# Altium schematic sheet Power.SchDoc
size A4; SheetNumber: 2; SheetTotal: 5
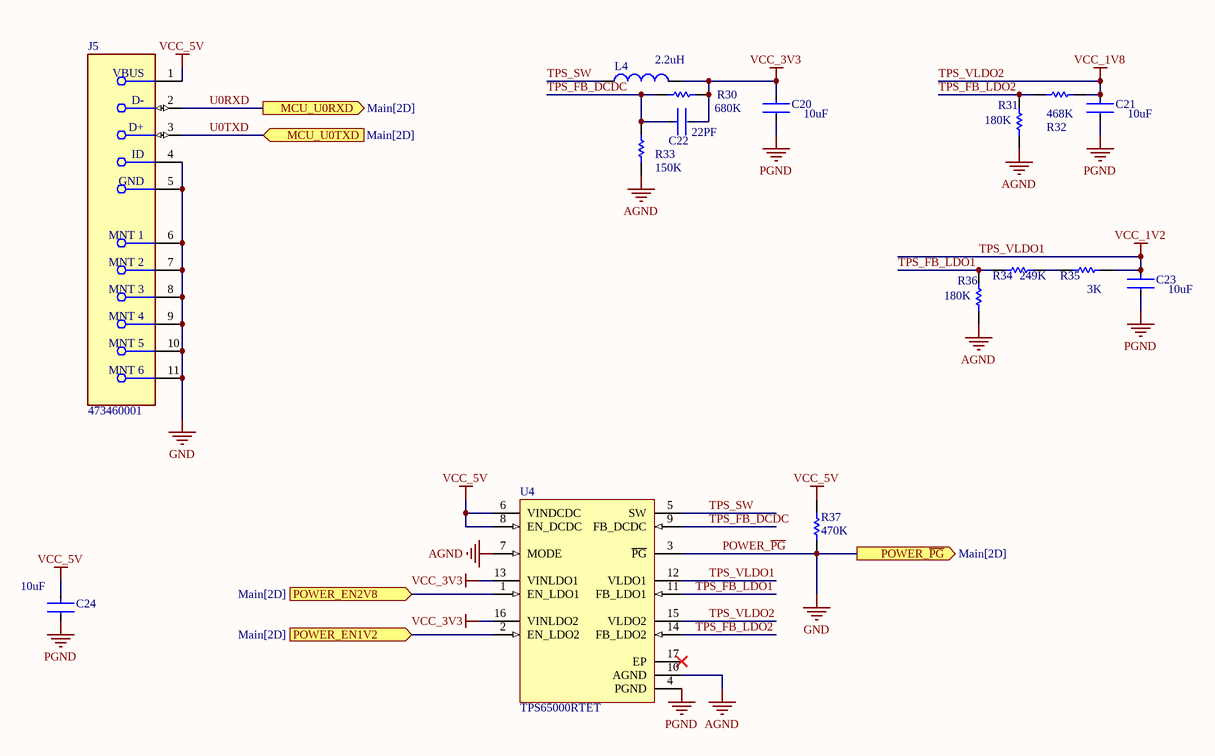
[diagram p0: Power.SchDoc]

## Parts
C20  10uF  [FP-C0402C106M9PACTU-MFG]
C21  10uF  [FP-C0402C106M9PACTU-MFG]
C22  22PF  [FP-C0402C106M9PACTU-MFG]
C23  10uF  [FP-C0402C106M9PACTU-MFG]
C24  10uF  [FP-C0402C106M9PACTU-MFG]
J5  473460001  [FP-473460001-MFG]
L4  2.2uH  [INDC2013X140X50LL20T20]
R30  680K  [RESC1005X40X25LL05T05]
R31  180K  [RESC1005X40X25LL05T05]
R32  468K  [RESC1005X40X25LL05T05]
R33  150K  [RESC1005X40X25LL05T05]
R34  249K  [RESC1005X40X25LL05T05]
R35  3K  [RESC1005X40X25LL05T05]
R36  180K  [RESC1005X40X25LL05T05]
R37  470K  [RESC1005X40X25LL05T05]
U4  TPS65000RTET  [RTE0016C]

## Ports
MCU_U0RXD (out, see Main[2D]), MCU_U0TXD (in, see Main[2D]), POWER_EN1V2 (in, see Main[2D]), POWER_EN2V8 (in, see Main[2D]), POWER_~{PG} (out, see Main[2D])

## Nets
AGND: R31.1 R33.1 R36.1 U4.7(MODE) U4.10(AGND)
PGND: C20.2 C21.2 C23.2 C24.2 U4.4(PGND)
POWER_~{PG}: J5.4(ID) J5.5(GND) J5.6(MNT_1) J5.7(MNT_2) J5.8(MNT_3) J5.9(MNT_4) J5.10(MNT_5) J5.11(MNT_6) R37.2 U4.3(~{PG}) ; port POWER_~{PG}  [also labelled GND]
TPS_VLDO1: C23.1 R35.1 U4.12(VLDO1)  [also labelled VCC_1V2]
TPS_VLDO2: C21.1 R32.1 U4.15(VLDO2)  [also labelled VCC_1V8]
VCC_3V3: C20.1 C22.2 L4.2 R30.1 U4.13(VINLDO1) U4.16(VINLDO2)
VCC_5V: C24.1 J5.1(VBUS) R37.1 U4.6(VINDCDC) U4.8(EN_DCDC)
POWER_EN1V2: U4.2(EN_LDO2) ; port POWER_EN1V2
POWER_EN2V8: U4.1(EN_LDO1) ; port POWER_EN2V8
TPS_FB_DCDC: C22.1 R30.2 R33.2 U4.9(FB_DCDC)
TPS_FB_LDO1: R34.2 R36.2 U4.11(FB_LDO1)
TPS_FB_LDO2: R31.2 R32.2 U4.14(FB_LDO2)
TPS_SW: L4.1 U4.5(SW)
U0RXD: J5.2(D-) ; port MCU_U0RXD
U0TXD: J5.3(D+) ; port MCU_U0TXD
NetR34_1: R34.1 R35.2

Not connected (* = marked no-connect by the designer): U4 17(EP)*

## Library data of the parts
C20-C24 = CMP-03020-034678-1: CAP CER 10UF 6.3V X5R 0402; Tolerance: 20%; Dielectric Material: Ceramic; Voltage Rating: 6.3V; Thickness: 0.028inch; REACH SVHC: No SVHC; RoHS Compliant: Yes; Case Code (Metric): 1005; Lead Free: Lead Free; Length: 0.039inch; Max Operating Temperature: 85°C; Capacitance: 10uF; Voltage Rating (DC): 6.3V; Min Operating Temperature: -55°C; Case/Package: 0402; Mount: Surface Mount; Case Code (Imperial): 0402; Dielectric: X5R; Packaging: Cut Tape; Width: 0.02inch
J5 = CMP-2000-05246-2: CONN RCPT USB2.0 MICRO B SMD R/A; Manufacturer: Molex; Conn Orientation: Right Angle; Is Female: yes; Shielding: true; Pitch: 0.65mm; Number Of Contacts: 5; Voltage Rating: 30V; Current Rating: 1.8A; Device Class L2: USB Connectors; Digikey Description: CONN RCPT USB2.0 MICRO B SMD R/A; Height: 2.945mm; RoHS: TRUE; ComponentLink2Description: Datasheet; Octopart: https://octopart.com/47346-0001-molex-7164928; Automotive: No; Package: 0; Category: Conn; Device Class L1: Connectors; Usb Standard: USB 2.0; Temperature: -30°C to +85°C; Temperature Range Low: -30°C; Footprint Url: https://www.molex.com/pdm_docs/sd/473460001_sd.pdf; ComponentLink2URL: https://www.molex.com/webdocs/datasheets/pdf/en-us/0473460001_IO_CONNECTORS.pdf; Lead Free: Yes; Manufacturer Part Number: 473460001; Contact Material: Gold,Nickel; Temperature Range High: +85°C; Device Class L3: unset
L4 = CMP-2000-05964-1: Wire-Wound Chip Power Inductor, 2.2 uH, +/- 20%, -40 to 105 degC, 2-Pin SMD (0805), RoHS, Tape and Reel; Manufacturer: Taiyo Yuden; Inductance: 2.2µH; Other Names: 587-2905-2 / LQBRC2012T2R2MD; Type: Wirewound; Current - Saturation: 1.1A; Online Catalog: BRSeries; EDA / CAD Models: DownloadfromAcceleratedDesigns; Shielding: Unshielded; DC Resistance (DCR): 143mOhmMax; Current Rating: 1A; Frequency - Test: 1MHz; Frequency - Self Resonant: 350MHz; Series: BR; Size / Dimension: 0.079"Lx0.049"W(2.00mmx1.25mm); Datasheet URL: http://ds.yuden.co.jp/TYCOMPAS/ut/detail.do?productNo=BRC2012T2R2MD&fileName=BRC2012T2R2MD_SS&mode=specSheetDownload; Tolerance: ±20%; Mounting Technology: SurfaceMount; Standard Package: 2,000; Category: Inductors,Coils,Chokes; Operating Temperature: -40°C~105°C; Mounting Type: SurfaceMount; Height - Seated (Max): 0.055"(1.40mm); Datasheet Version: 09/2016; Package Reference: 0805; Package Description: 2-Pin Surface Mount Device, Body 2 x 1.25 mm; Packaging: Tape&Reel(TR); Package / Case: 0805(2012Metric); Family: FixedInductors; Manufacturer URL: http://www.t-yuden.com/
R30-R37 = CMP-2002-08382-1: Manufacturer: Vishay Dale; Part Number: CRCW040222R0FKED
U4 = CMP-1518-00005-2: 0.6 A, 2.25 MHz Step-Down Converter with Dual LDOs & SVS, 2.3 to 6 V, -40 to 85 degC, 16-pin WQFN (RTE), Green (RoHS & no Sb/Br); Manufacturer: Texas Instruments; Packing: Small Tape and Reel; Iout(Max)(A): 0.6; Eco-Plan: TRUE; Step-Down DC/DC Converter: 1; Regulated Outputs(#): 3; PartNumber: TPS65000RTET; PackageDescription: 16-Pin Plastic Flat Pack, Body 3 x 3 mm, Pitch 0.5 mm; ComponentLink2URL: http://www.ti.com/lit/ds/symlink/tps65000.pdf; ComponentLink3URL: http://www.ti.com/litv/pdf/mpqf149c; Mounting Technology: Surface Mount; ComponentLink1URL: http://www.ti.com/; ComponentLink1Description: Manufacturer URL; ComponentLink2Description: Datasheet; PackageReference: RTE0016C; DatasheetVersion: SLVS810B; ComponentLink3Description: Package Specification; Code_JEDEC: MO-220; PackageVersion: 4205254/D, 01/2011